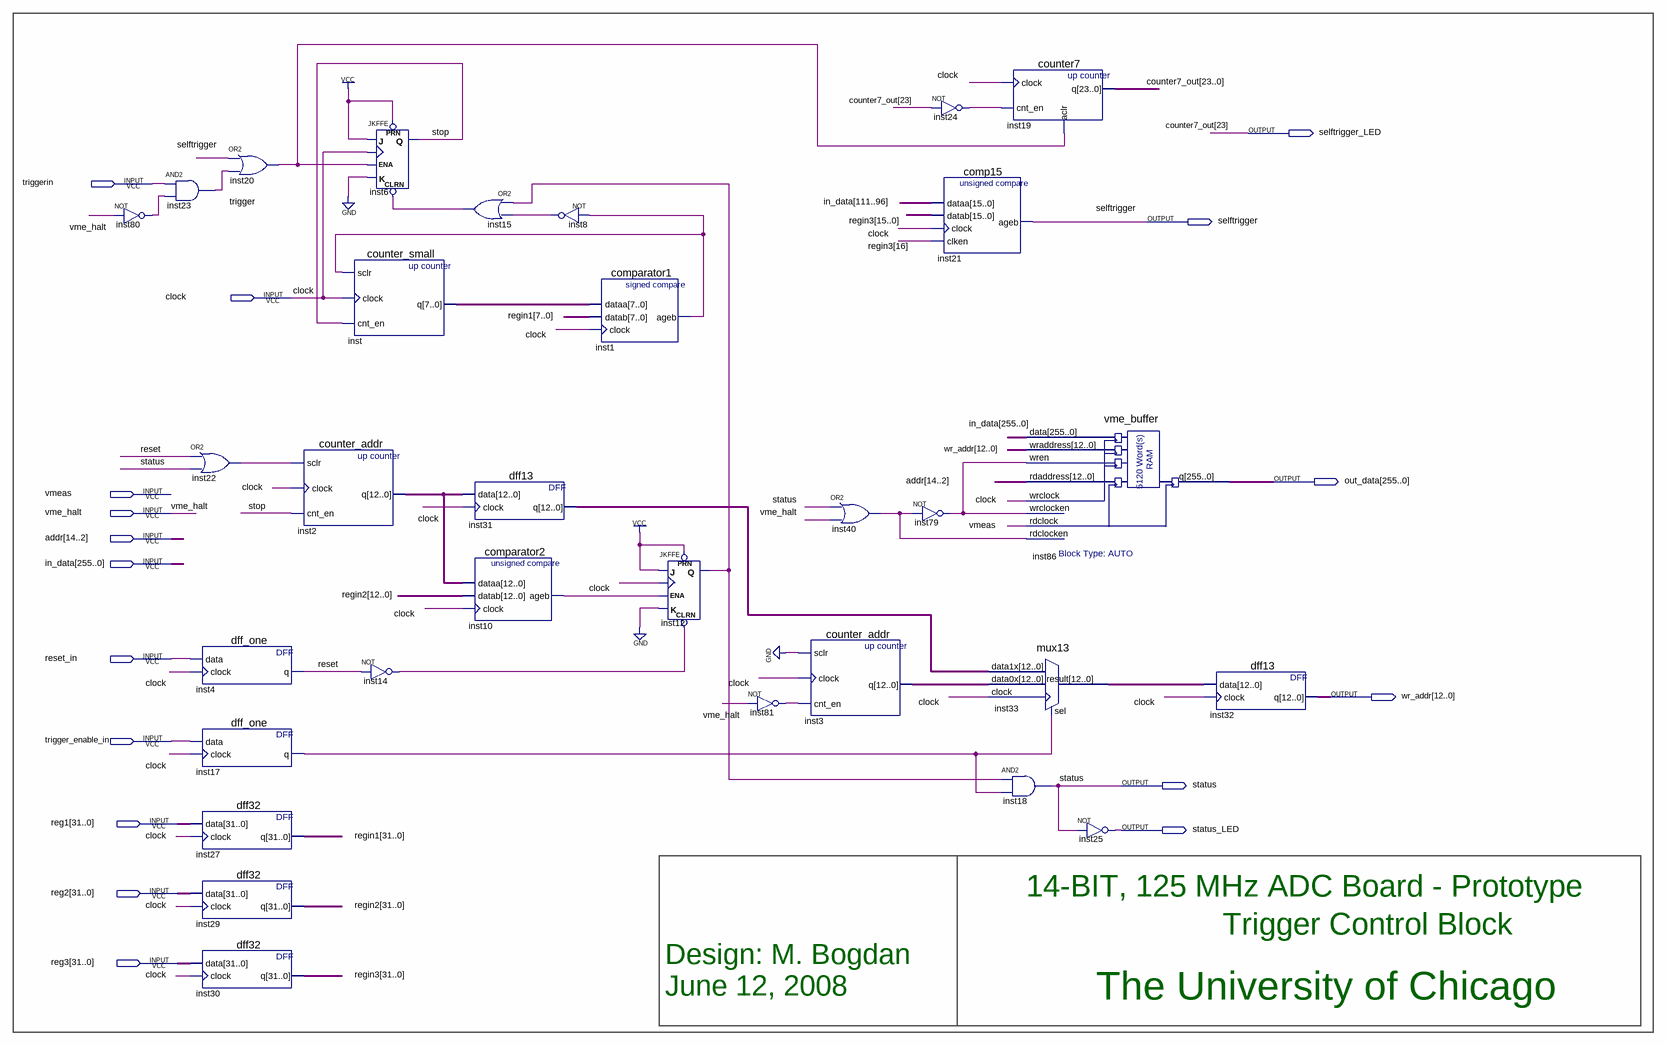
[diagram p0: schematic sheet]
// Quartus schematic trigger_control.bdf as structural Verilog: 31 symbols, 17 pins
module trigger_control (
  input  triggerin,
  input  clock,
  input  vmeas,
  input  vme_halt,
  input  [14:2] addr,
  input  [255:0] in_data,
  input  reset_in,
  input  trigger_enable_in,
  input  [31:0] reg1,
  input  [31:0] reg2,
  input  [31:0] reg3,
  output selftrigger_LED,
  output selftrigger,
  output [255:0] out_data,
  output [12:0] wr_addr,
  output status,
  output status_LED
);

  wire inst1_ageb, inst8_out, inst10_ageb, inst12_q, inst14_out, inst15_out, inst17_q, inst20_out,
       inst22_out, inst24_out, inst40_out, inst79_out, inst80_out, inst81_out, reset, stop, trigger;
  wire [7:0] inst_q;
  wire [12:0] inst2_q, inst3_q, inst31_q, inst33_result;
  wire [22:0] counter7_out;
  wire [31:0] regin1, regin2, regin3;

  not inst80 (inst80_out, vme_halt);
  and inst23 (trigger, triggerin, inst80_out);
  or inst22 (inst22_out, reset, status);
  dff_one inst4 (.data(reset_in), .clock(clock), .q(reset));
  dff_one inst17 (.data(trigger_enable_in), .clock(clock), .q(inst17_q));
  dff32 inst27 (.data(reg1), .clock(clock), .q(regin1));
  dff32 inst29 (.data(reg2), .clock(clock), .q(regin2));
  dff32 inst30 (.data(reg3), .clock(clock), .q(regin3));
  or inst20 (inst20_out, selftrigger, trigger);
  counter_addr inst2 (.sclr(inst22_out), .clock(clock), .cnt_en(stop), .q(inst2_q));
  JKFFE inst6 (.PRN(1'b1), .J(1'b1), .CLK(clock), .CLRN(inst15_out), .K(1'b0), .ENA(inst20_out), .Q(stop));
  counter_small inst (.sclr(inst1_ageb), .clock(clock), .cnt_en(stop), .q(inst_q));
  not inst14 (inst14_out, reset);
  or inst15 (inst15_out, inst12_q, inst8_out);
  dff13 inst31 (.data(inst2_q), .clock(clock), .q(inst31_q));
  comparator2 inst10 (.dataa(inst2_q), .datab(regin2[12:0]), .clock(clock), .ageb(inst10_ageb));
  not inst8 (inst8_out, inst1_ageb);
  comparator1 inst1 (.dataa(inst_q), .datab(regin1[7:0]), .clock(clock), .ageb(inst1_ageb));
  JKFFE inst12 (.PRN(1'b1), .J(1'b1), .CLK(clock), .CLRN(inst14_out), .K(1'b0), .ENA(inst10_ageb), .Q(inst12_q));
  not inst81 (inst81_out, vme_halt);
  or inst40 (inst40_out, status, vme_halt);
  counter_addr inst3 (.sclr(1'b0), .clock(clock), .cnt_en(inst81_out), .q(inst3_q));
  not inst24 (inst24_out, selftrigger_LED);
  comp15 inst21 (.dataa(in_data[111:96]), .datab(regin3[15:0]), .clock(clock), .clken(regin3[16]), .ageb(selftrigger));
  not inst79 (inst79_out, inst40_out);
  counter7 inst19 (.clock(clock), .cnt_en(inst24_out), .aclr(inst20_out), .q({selftrigger_LED, counter7_out}));
  vme_buffer inst86 (
    .data(in_data), .wraddress(wr_addr), .wren(inst79_out), .rdaddress(addr), .wrclock(clock),
    .wrclocken(inst79_out), .rdclock(vmeas), .rdclocken(inst40_out), .q(out_data));
  mux13 inst33 (.data1x(inst31_q), .data0x(inst3_q), .clock(clock), .sel(inst17_q), .result(inst33_result));
  and inst18 (status, inst12_q, inst17_q);
  not inst25 (status_LED, status);
  dff13 inst32 (.data(inst33_result), .clock(clock), .q(wr_addr));

  // Other names for the same wires on the sheet: counter7_out[23] = selftrigger_LED

  // Notes on the sheet:
  //   14-BIT, 125 MHz ADC Board - Prototype
  //   Trigger Control Block
  //   Design: M. Bogdan
  //   The University of Chicago
  //   June 12, 2008
endmodule
